# EAGLE design front_end_mk1 (EAGLE 8.7.0)
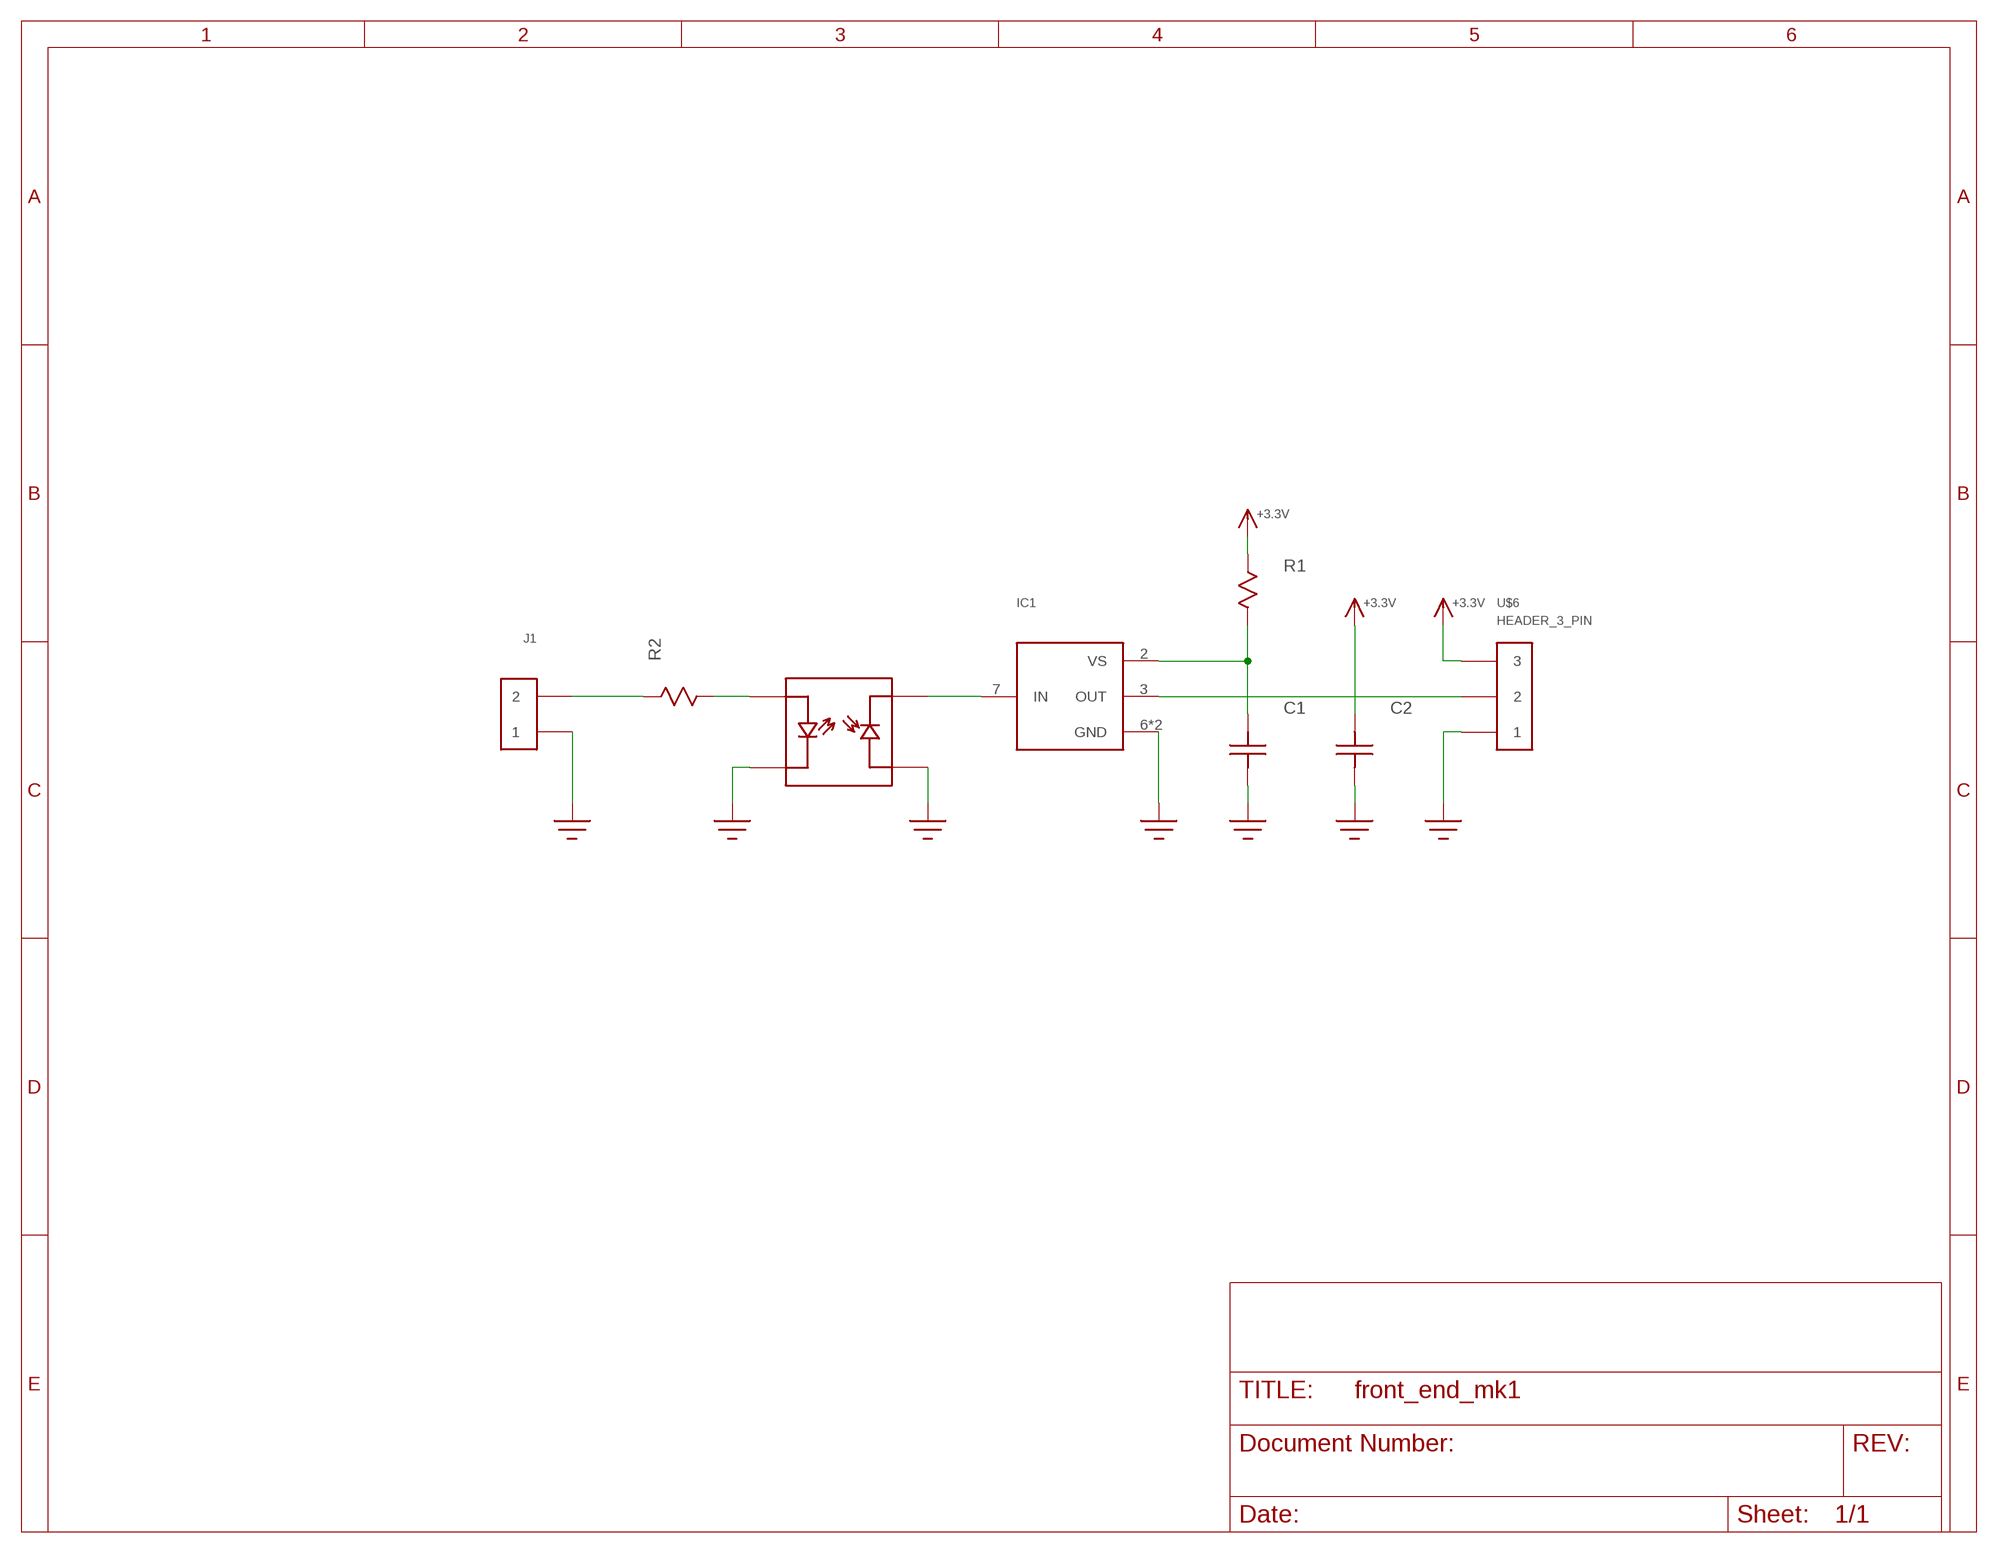
[diagram p0: schematic, sheet 1]

## Parts
C1  C0603  [C0603]
C2  C0805  [0805]
IC1  VSOP98260  [VSOP98260]
IC2  HSDL-9100  [HDSL-9100]
J1  HEADER_2_PIN  [HEADER_2_PIN]
R1  R0603  [R0603]
R2  R1206  [R1206]
U$6  HEADER_3_PIN  [HEADER_3_PIN]

## Nets
+3.3V: C2.P$2 R1.P$1 U$6.3
GND: C1.P$1 C2.P$1 IC1.6(GND) IC1.8(GND) IC2.2(LED_CATHODE) IC2.3(PHOTODIODE_ANODE) J1.1 U$6.1
N$1: IC1.7(IN) IC2.4(PHOTODIODE_CATHODE)
N$2: C1.P$2 IC1.2(VS) R1.P$2
N$3: IC2.1(LED_ANODE) R2.P$2
N$4: IC1.3(OUT) U$6.2
N$5: J1.2 R2.P$1

## Library data of the parts
C1 C2 = ssir:C
IC1 = ssir:VSOP98260
IC2 = ssir:HSDL-9100
J1 = ssir:HEADER_2_PIN
R1 R2 = ssir:R
U$6 = ssir:HEADER_3_PIN

## Board
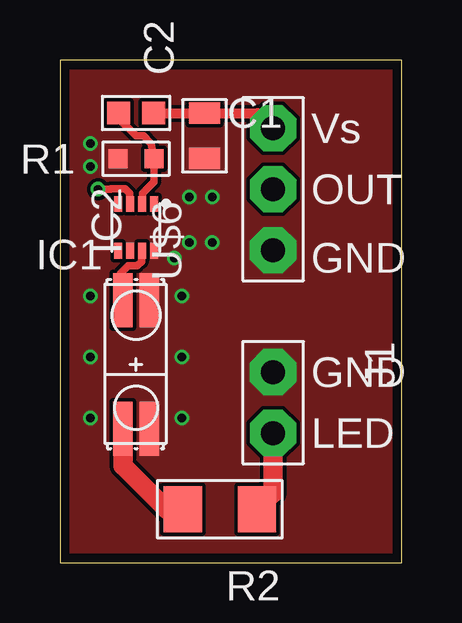
[diagram p1: board, top side]
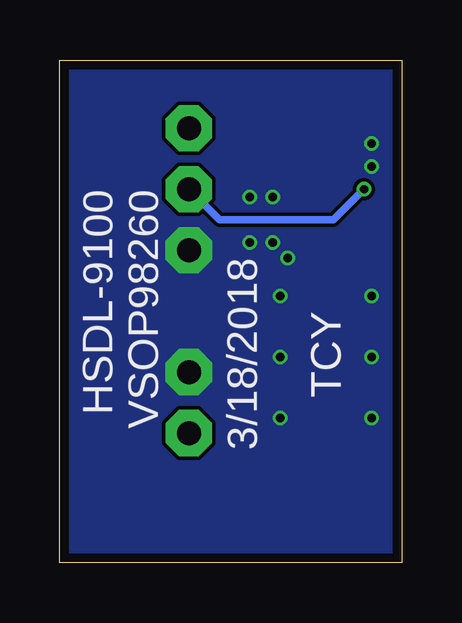
[diagram p2: board, bottom side, seen from below]

Size 14.27 x 20.94 mm. Coordinates in mm from the lower left corner, seen from the top.
Outline: 0,0 14.27,0 14.27,20.94 0,20.94 0,0
Copper layers (1*16): Top 0.035559375mm / dielectric 1.6mm / Bottom 0.035559375mm
Design rules "oshpark-2layer": minimum track width 6mil, minimum drill 10mil, track to track 6mil, track to pad 6mil, pad to pad 6mil, via to via 6mil, smd to smd 6mil, copper to edge 15mil, drill to drill 6mil, minimum pad ring 5mil, minimum via ring 5mil, stop-mask expansion 2.5mil, vias tented up to drill 0mil, thermal gap 10mil

### Footprints (pad centres in the part's own frame; a part is rotated, then mirrored left to right if it is on the bottom)
C0603 = smd 0.8 x 0.8: P$1 -0.75,0; P$2 0.75,0
0805 = smd 0.9 x 1.3: P$1 -0.95,0; P$2 0.95,0
VSOP98260 = smd 0.33 x 0.65: 1 -0.75,-0.975; 2 -0.25,-0.975; 3 0.25,-0.975; 4 0.75,-0.975; 5 0.75,0.975; 6 0.25,0.975; 7 -0.25,0.975; 8 -0.75,0.975
HDSL-9100 = smd 2.25 x 0.8: 1 -2.675,0.55; 2 -2.675,-0.55; 3 2.675,-0.55; 4 2.675,0.55
HEADER_2_PIN = drill 1 pad 1.93 octagon: 1 -1.27,0; 2 1.27,0
R0603 = smd 0.95 x 0.95: P$1 -0.725,0; P$2 0.725,0
R1206 = smd 1.6 x 1.9: P$1 -1.55,0; P$2 1.55,0
HEADER_3_PIN = drill 1 pad 1.93 octagon: 1 -2.54,0; 2 0,0; 3 2.54,0

### Placement (x,y rotation side)
C1  3.17,16.83 0 top
C2  6.03,17.78 90 top
IC1  3.17,13.97 180 top
IC2  3.17,8.26 90 top
J1  8.89,6.67 270 top
R1  3.17,18.73 180 top
R2  6.67,2.22 180 top
U$6  8.89,15.56 90 top

### Tracks (layer width: path | path; a pad name or v marks a point on that pad's centre or on a via)
+3.3V
  Top 0.406: R1.P$1 C2.P$2 8.26,18.73 U$6.3
GND  (via drill 0.35)
  other vias: 5.4,15.24 6.35,15.24 6.35,13.34 5.4,13.34 1.27,11.11 1.27,8.57 1.27,6.03 5.08,6.03 5.08,8.57 5.08,11.11 4.76,12.7 1.27,17.46 1.27,16.51
  pour Top (no thermals): 0,0 14.29,0 14.29,20.95 0,20.95
  pour Bottom (no thermals): 0,0 14.29,0 14.29,20.95 0,20.95
N$1
  Top 0.305: IC1.7 3.4,12.97 3.4,12.54 3.23,12.37 2.84,12.37 2.54,12.06 IC2.4
N$2
  Top 0.305: IC1.2 3.44,14.96 3.44,15.4 3.92,15.88 C1.P$2 3.81,17.46 3.49,17.78 3.17,17.78 2.45,18.5 R1.P$2
N$3
  Top 0.813: R2.P$2 4.45,2.22 2.62,4.04 IC2.1
N$4  (via drill 0.35)
  Top 0.305: IC1.3 2.9,14.96 2.9,15.4 2.73,15.57 2.12,15.57 2.11,15.56 v1.59,15.56
  Bottom 0.305: v1.59,15.56 2.86,14.29 7.62,14.29 U$6.2
N$5
  Top 0.813: J1.2 8.89,2.9 R2.P$1

### Text on the board
tPlace: Vs | OUT | GND | GND | LED
bPlace: VSOP98260 | HSDL-9100 | 3/18/2018 | TCY